# Altium schematic sheet Inputs.SchDoc
size A4; DocumentNumber: 2; SheetNumber: 2
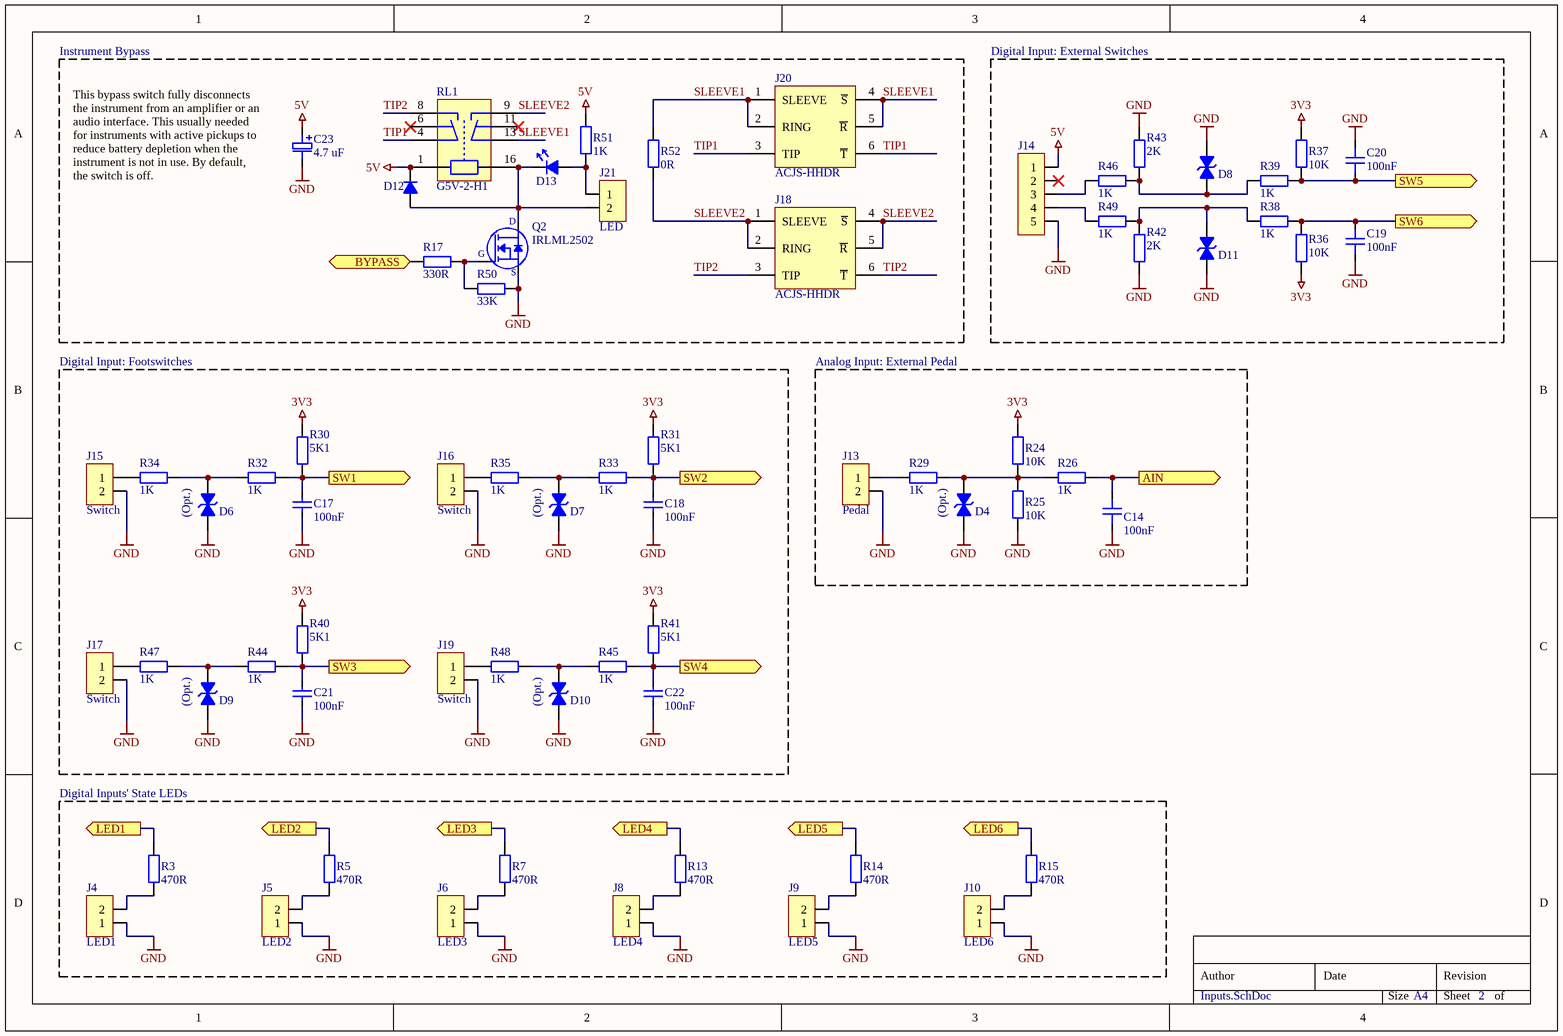
[diagram p0: Inputs.SchDoc]

## Parts
C14  100nF  [0603C_RF_M]
C17  100nF  [0603C_RF_M]
C18  100nF  [0603C_RF_M]
C19  100nF  [0603C_RF_M]
C20  100nF  [0603C_RF_M]
C21  100nF  [0603C_RF_M]
C22  100nF  [0603C_RF_M]
C23  4.7 uF  [C_EL_B_4MM_RF_M]
D4  TVS  [NXP_SOD-323_RF_M]  (value not drawn)
D6  TVS  [NXP_SOD-323_RF_M]  (value not drawn)
D7  TVS  [NXP_SOD-323_RF_M]  (value not drawn)
D8  TVS  [NXP_SOD-323_RF_M]  (value not drawn)
D9  TVS  [NXP_SOD-323_RF_M]  (value not drawn)
D10  TVS  [NXP_SOD-323_RF_M]  (value not drawn)
D11  TVS  [NXP_SOD-323_RF_M]  (value not drawn)
D12  D  [NXP_SOD-323_RF_M]  (value not drawn)
D13  LED  [0805LED_RF_M]  (value not drawn)
J4  LED1  [HEADER-2.54-2P1]
J5  LED2  [HEADER-2.54-2P1]
J6  LED3  [HEADER-2.54-2P1]
J8  LED4  [HEADER-2.54-2P1]
J9  LED5  [HEADER-2.54-2P1]
J10  LED6  [HEADER-2.54-2P1]
J13  Pedal  [HEADER-2.54-2P1]
J14  PINHDR_5x1  [HEADER-2.54-5P1]  (value not drawn)
J15  Switch  [HEADER-2.54-2P1]
J16  Switch  [HEADER-2.54-2P1]
J17  Switch  [HEADER-2.54-2P1]
J18  ACJS-HHDR  [ACJS-HHDR]
J19  Switch  [HEADER-2.54-2P1]
J20  ACJS-HHDR  [ACJS-HHDR]
J21  LED  [HEADER-2.54-2P1]
Q2  IRLML2502  [IRLML_SOT-23]
R3  470R  [0603R_RF_M]
R5  470R  [0603R_RF_M]
R7  470R  [0603R_RF_M]
R13  470R  [0603R_RF_M]
R14  470R  [0603R_RF_M]
R15  470R  [0603R_RF_M]
R17  330R  [0603R_RF_M]
R24  10K  [0603R_RF_M]
R25  10K  [0603R_RF_M]
R26  1K  [0603R_RF_M]
R29  1K  [0603R_RF_M]
R30  5K1  [0603R_RF_M]
R31  5K1  [0603R_RF_M]
R32  1K  [0603R_RF_M]
R33  1K  [0603R_RF_M]
R34  1K  [0603R_RF_M]
R35  1K  [0603R_RF_M]
R36  10K  [0603R_RF_M]
R37  10K  [0603R_RF_M]
R38  1K  [0603R_RF_M]
R39  1K  [0603R_RF_M]
R40  5K1  [0603R_RF_M]
R41  5K1  [0603R_RF_M]
R42  2K  [0603R_RF_M]
R43  2K  [0603R_RF_M]
R44  1K  [0603R_RF_M]
R45  1K  [0603R_RF_M]
R46  1K  [0603R_RF_M]
R47  1K  [0603R_RF_M]
R48  1K  [0603R_RF_M]
R49  1K  [0603R_RF_M]
R50  33K  [0603R_RF_M]
R51  1K  [0603R_RF_M]
R52  0R  [0805R_RF_M]
RL1  G5V-2-H1  [G5V-2-H1]

## Blocks framed on the sheet
Instrument Bypass: C23 D12 D13 J18 J20 J21 Q2 R17 R50-R52 RL1
Digital Input: External Switches: C19 C20 D8 D11 J14 R36-R39 R42 R43 R46 R49
Digital Inputs' State LEDs: J4-J6 J8-J10 R3 R5 R7 R13-R15

## Ports
AIN (out), BYPASS (in), LED1 (out), LED2 (out), LED3 (out), LED4 (out), LED5 (out), LED6 (out), SW1 (out), SW2 (out), SW3 (out), SW4 (out), SW5 (out), SW6 (out)

## Nets
3V3: R24.2 R30.1 R31.1 R36.2 R37.2 R40.1 R41.1
5V: C23.P D12.C J14.1 R51.2 RL1.1(SW)
GND: C14.1 C17.1 C18.1 C19.2 C20.1 C21.1 C22.1 C23.N D4.A D6.A D7.A D8.A D9.A D10.A D11.A J4.1 J5.1 J6.1 J8.1 J9.1 J10.1 J13.2 J14.5 J15.2 J16.2 J17.2 J19.2 Q2.2(S) R25.1 R42.2 R43.1 R50.2
AIN: C14.2 R26.2 ; port AIN
BYPASS: R17.1 ; port BYPASS
LED1: R3.2 ; port LED1
LED2: R5.2 ; port LED2
LED3: R7.2 ; port LED3
LED4: R13.2 ; port LED4
LED5: R14.2 ; port LED5
LED6: R15.2 ; port LED6
SLEEVE1: J20.1(SLEEVE) J20.2(RING) J20.4(~{S}) J20.5(~{R}) R52.2 RL1.13(COM2)
SLEEVE2: J18.1(SLEEVE) J18.2(RING) J18.4(~{S}) J18.5(~{R}) R52.1 RL1.9(NO2)
SW1: C17.2 R30.2 R32.2 ; port SW1
SW2: C18.2 R31.2 R33.2 ; port SW2
SW3: C21.2 R40.2 R44.2 ; port SW3
SW4: C22.2 R41.2 R45.2 ; port SW4
SW5: C20.2 R37.1 R39.2 ; port SW5
SW6: C19.1 R36.1 R38.2 ; port SW6
TIP1: J20.3(TIP) J20.6(~{T}) RL1.4(COM1)
TIP2: J18.3(TIP) J18.6(~{T}) RL1.8(NO1)
NetD4_C: D4.C R24.1 R25.2 R26.1 R29.2
NetD6_C: D6.C R32.1 R34.2
NetD7_C: D7.C R33.1 R35.2
NetD8_C: D8.C R39.1 R43.2 R46.2
NetD9_C: D9.C R44.1 R47.2
NetD10_C: D10.C R45.1 R48.2
NetD11_C: D11.C R38.1 R42.1 R49.2
NetD12_A: D12.A D13.C J21.2 Q2.3(D) RL1.16(SW)
NetD13_A: D13.A J21.1 R51.1
NetJ4_2: J4.2 R3.1
NetJ5_2: J5.2 R5.1
NetJ6_2: J6.2 R7.1
NetJ8_2: J8.2 R13.1
NetJ9_2: J9.2 R14.1
NetJ10_2: J10.2 R15.1
NetJ13_1: J13.1 R29.1
NetJ14_3: J14.3 R46.1
NetJ14_4: J14.4 R49.1
NetJ15_1: J15.1 R34.1
NetJ16_1: J16.1 R35.1
NetJ17_1: J17.1 R47.1
NetJ19_1: J19.1 R48.1
NetQ2_1: Q2.1(G) R17.2 R50.1

Not connected (* = marked no-connect by the designer): J14 2*; RL1 6(NC1)* 11(NC2)*

## Notes on the sheet
- (near C23) This bypass switch fully disconnects the instrument from an amplifier or an audio interface. This usually needed for instruments with active pickups to reduce battery depletion when the instrument is not in use. By default, the switch is off.
- Digital Input: Footswitches
- Analog Input: External Pedal
- (Opt.)
- (near R29) (Opt.)
- Author
- Date
- Revision
- Size
- A4
- Sheet
- of

## Library data of the parts
C14 C17-C22 = C: Capacitor; Manufacturer: Generic Brand; Max Voltage: ? V; Value: 100nF; Tolerance: ?; Manufacturer Part No: *; Supplier: *; Supplier Link: http://; Supplier Part No: *; Category: Capacitor; Mounting Technology: SMT
C23 = C-P: Polarized Capacitor; Manufacturer: Generic Brand; Max Voltage: ? V; Value: 4.7 uF; Mounting Technology: SMT; Tolerance: ?; Tag: *; Manufacturer Part No: *; Supplier: *; Supplier Link: http://; Supplier Part No: *; Category: Capacitor
D4 D6-D11 = D-TVS: TVS Diode Bidirectional; Manufacturer: Generic Brand; Power Rating: ? W; Manufacturer Part No: *; Supplier: *; Supplier Link: http://; Supplier Part No: *; Mounting Technology: SMT; Category: Diode
D12 = D: Diode (Rectifier); Manufacturer: Generic Brand; Max Forward Voltage: ? V; Power Rating: ? W; Manufacturer Part No: *; Supplier: *; Supplier Link: http://; Supplier Part No: *; Mounting Technology: SMT; Category: Diode
D13 = LED: Manufacturer: Generic Brand; Emitting Color: Unspecified; Forward Voltage Drop: ? V; Manufacturer Part No: *; Supplier: *; Supplier Link: http://; Supplier Part No: *; Mounting Technology: SMT; Category: Diode
J4-J6 J8-J10 J15-J17 J19 J21 = PINHDR_2x1: Generic Pin Header 2x1
J13 = PINHDR-2P1: Pin Header Single Row 2 Positions; Mounting Technology: THT
J14 = PINHDR_5x1: Generic Pin Header 5x1
J18 J20 = ACJS-HHDR: 1/4" Stereo Jack PCB Receptacle; Manufacturer: Amphenol; Manufacturer Product No: ACJM-HHDR; Alternative Supplier: Belchip; Alternative Supplier Link: https://belchip.by/product/?selected_product=44079; Alternative Supplier Part No: 44079; Mounting Technology: HMT
Q2 = IRLML2502: MOSFET N-CH 20V 4.2A SOT23; Manufacturer: Infineon; Manufacturer Part No: IRLML2502TRPBF; Supplier: DigiKey; Supplier Link: https://www.digikey.com/en/products/detail/infineon-technologies/IRLML2502TRPBF/811439; Supplier Part No: IRLML2502TRPBFCT-ND; Mounting Technology: SMT; Package: SOT-23; Alternative Supplier: Chipdip; Alternative Supplier Part No: 517112745; Alternative Supplier Link: https://www.chipdip.by/product/irlml2502tr
R3 R5 R7 R13-R15 R17 R24-R26 R29-R52 = R: Resistor; Manufacturer: Generic Brand; Max Voltage: ? V; Power Rating: ? W; Tolerance: ?; Manufacturer Part No: *; Supplier: *; Supplier Link: http://; Supplier Part No: *; Category: Resistor; Mounting Technology: SMT
  R3 R5 R7 R13-R15: Value: 470R
  R17: Value: 330R
  R24 R25 R36 R37: Value: 10K
  R26 R29 R32-R35 R38 R39 R44-R49 R51: Value: 1K
  R30 R31 R40 R41: Value: 5K1
  R42 R43: Value: 2K
  R50: Value: 33K
  R52: Value: 0R
RL1 = G5V-2-H1: RELAY GEN PURPOSE DPDT 1A 5VDC; Manufacturer: Omron; Manufacturer Part No: G5V-2-H1 DC5; Compatible Model: TIANBO HJR1-2C; Alternative Supplier Link: https://belchip.by/product/?selected_product=32041; Alternative Supplier: Belchip; Alternative Supplier Part No: 32041; Mounting Technology: THT; Supplier Part No: Z108-ND; Supplier Link: https://www.digikey.com/en/products/detail/omron-electronics-inc-emc-div/G5V-2-H1-DC5/277844; Supplier: DigiKey